# Altium schematic sheet Blue Tractor_v1.1-2021.SchDoc
size A4
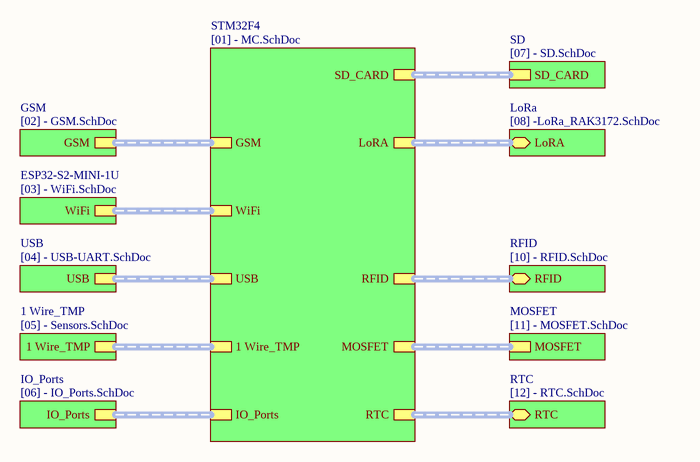
[diagram p0: Blue Tractor_v1.1-2021.SchDoc]

## Sub-sheets
1 Wire_TMP = [05] - Sensors.SchDoc: 1 Wire_TMP (harness 1-Wire_TMP)
ESP32-S2-MINI-1U = [03] - WiFi.SchDoc: WiFi (harness WiFi)
GSM = [02] - GSM.SchDoc: GSM (harness GSM)
IO_Ports = [06] - IO_Ports.SchDoc: IO_Ports (harness IO_Ports)
LoRa = [08] -LoRa_RAK3172.SchDoc: LoRA (harness LoRa_UART)
MOSFET = [11] - MOSFET.SchDoc: MOSFET (harness MOSFET)
RFID = [10] - RFID.SchDoc: RFID (harness RFID)
RTC = [12] - RTC.SchDoc: RTC (harness RTC)
SD = [07] - SD.SchDoc: SD_CARD (harness SD_CARD)
STM32F4 = [01] - MC.SchDoc: RFID (harness RFID), USB (harness USB), LoRA (harness LoRa_UART), WiFi (harness WiFi), SD_CARD (harness SD_CARD), GSM (harness GSM), 1 Wire_TMP (harness 1-Wire_TMP), IO_Ports (harness IO_Ports), RTC (harness RTC), MOSFET (harness MOSFET)
USB = [04] - USB-UART.SchDoc: USB (harness USB)

## Buses and harness runs
harness sheet 1 Wire_TMP/1 Wire_TMP = sheet STM32F4/1 Wire_TMP
harness sheet ESP32-S2-MINI-1U/WiFi = sheet STM32F4/WiFi
harness sheet GSM/GSM = sheet STM32F4/GSM
harness sheet IO_Ports/IO_Ports = sheet STM32F4/IO_Ports
harness sheet LoRa/LoRA = sheet STM32F4/LoRA
harness sheet MOSFET/MOSFET = sheet STM32F4/MOSFET
harness sheet RFID/RFID = sheet STM32F4/RFID
harness sheet RTC/RTC = sheet STM32F4/RTC
harness sheet SD/SD_CARD = sheet STM32F4/SD_CARD
harness sheet STM32F4/USB = sheet USB/USB

## Notes on the sheet
- Title
- Size:
- Date:
- A4
- Number:
- Time:
- Revision:
- Sheet
- of
- File: